# EAGLE schematic atmega_328p_tqfp (EAGLE 9.1.3)
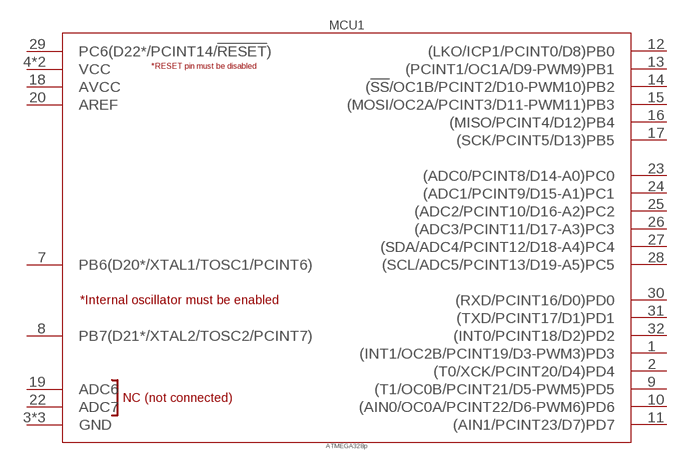
[diagram p0: schematic, sheet 1]

## Parts
MCU1  ATMEGA328p  ATMEGA328P-32_TQFP-32_ATMEGA328P  [QFP80P900X900X120-32]
Unconnected: MCU1.1((INT1/OC2B/PCINT19/D3-PWM3)PD3) MCU1.2((T0/XCK/PCINT20/D4)PD4) MCU1.7(PB6(D20*/XTAL1/TOSC1/PCINT6)) MCU1.8(PB7(D21*/XTAL2/TOSC2/PCINT7)) MCU1.9((T1/OC0B/PCINT21/D5-PWM5)PD5) MCU1.10((AIN0/OC0A/PCINT22/D6-PWM6)PD6) MCU1.11((AIN1/PCINT23/D7)PD7) MCU1.12((LKO/ICP1/PCINT0/D8)PB0) MCU1.13((PCINT1/OC1A/D9-PWM9)PB1) MCU1.14((!SS!/OC1B/PCINT2/D10-PWM10)PB2) MCU1.15((MOSI/OC2A/PCINT3/D11-PWM11)PB3) MCU1.16((MISO/PCINT4/D12)PB4) MCU1.17((SCK/PCINT5/D13)PB5) MCU1.19(ADC6) MCU1.20(AREF) MCU1.22(ADC7) MCU1.23((ADC0/PCINT8/D14-A0)PC0) MCU1.24((ADC1/PCINT9/D15-A1)PC1) MCU1.25((ADC2/PCINT10/D16-A2)PC2) MCU1.26((ADC3/PCINT11/D17-A3)PC3) MCU1.27((SDA/ADC4/PCINT12/D18-A4)PC4) MCU1.28((SCL/ADC5/PCINT13/D19-A5)PC5) MCU1.29(PC6(D22*/PCINT14/!RESET!)) MCU1.30((RXD/PCINT16/D0)PD0) MCU1.31((TXD/PCINT17/D1)PD1) MCU1.32((INT0/PCINT18/D2)PD2)

## Power pins joined to a net without a drawn wire
AVCC: MCU1.18(AVCC)
GND: MCU1.3(GND) MCU1.5(GND) MCU1.21(GND)
VCC: MCU1.4(VCC) MCU1.6(VCC)

## Library data of the parts
MCU1 = PiB_ic_microcontrollers:ATMEGA328P-32: 32 pin ATMEGA328P IC; DATASHEET: http://ww1.microchip.com/downloads/en/DeviceDoc/Atmel-42735-8-bit-AVR-Microcontroller-ATmega328-328P_Datasheet.pdf; DATASHEET2: http://ww1.microchip.com/downloads/en/DeviceDoc/Atmel-42735-8-bit-AVR-Microcontroller-ATmega328-328P_Summary.pdf; DIST: Digikey; DISTLINK: https://www.digikey.com/products/en?keywords=ATMEGA328P-AU-ND; DISTPN: ATMEGA328P-AU-ND; MFR: Microchip Technology; MPN: ATMEGA328P-AU